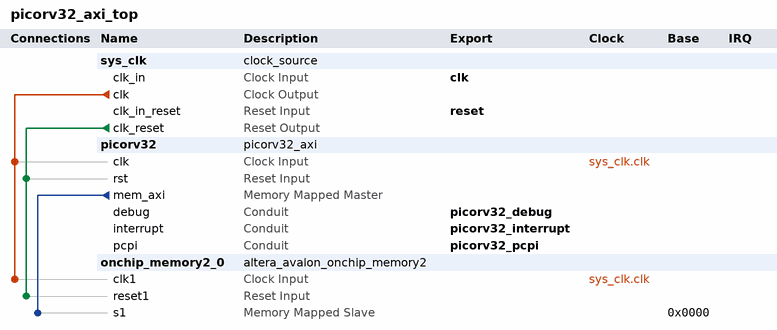
[diagram p0: system contents]
# Platform Designer (Qsys) system picorv32_axi_top, Cyclone V 5CEBA2F17A7
# Parameters at their usual value, and those the tool derives, are not listed.
package require -exact qsys 21.1
create_system picorv32_axi_top
set_project_property DEVICE_FAMILY {Cyclone V}
set_project_property DEVICE 5CEBA2F17A7

add_instance sys_clk clock_source 21.1
set_instance_parameter_value sys_clk clockFrequency 50000000

add_instance picorv32 picorv32_axi 1.0
set_instance_parameter_value picorv32 BARREL_SHIFTER 0
set_instance_parameter_value picorv32 CATCH_ILLINSN 1
set_instance_parameter_value picorv32 CATCH_MISALIGN 1
set_instance_parameter_value picorv32 COMPRESSED_ISA 0
set_instance_parameter_value picorv32 ENABLE_COUNTERS 1
set_instance_parameter_value picorv32 ENABLE_COUNTERS64 1
set_instance_parameter_value picorv32 ENABLE_DIV 0
set_instance_parameter_value picorv32 ENABLE_FAST_MUL 0
set_instance_parameter_value picorv32 ENABLE_IRQ 0
set_instance_parameter_value picorv32 ENABLE_IRQ_QREGS 1
set_instance_parameter_value picorv32 ENABLE_IRQ_TIMER 1
set_instance_parameter_value picorv32 ENABLE_MUL 0
set_instance_parameter_value picorv32 ENABLE_PCPI 0
set_instance_parameter_value picorv32 ENABLE_REGS_16_31 1
set_instance_parameter_value picorv32 ENABLE_REGS_DUALPORT 1
set_instance_parameter_value picorv32 ENABLE_TRACE 0
set_instance_parameter_value picorv32 LATCHED_IRQ 4294967295
set_instance_parameter_value picorv32 MASKED_IRQ 0
set_instance_parameter_value picorv32 PROGADDR_IRQ 16
set_instance_parameter_value picorv32 PROGADDR_RESET 0
set_instance_parameter_value picorv32 REGS_INIT_ZERO 0
set_instance_parameter_value picorv32 STACKADDR 4294967295
set_instance_parameter_value picorv32 TWO_CYCLE_ALU 0
set_instance_parameter_value picorv32 TWO_CYCLE_COMPARE 0
set_instance_parameter_value picorv32 TWO_STAGE_SHIFT 1

add_instance onchip_memory2_0 altera_avalon_onchip_memory2 21.1
set_instance_parameter_value onchip_memory2_0 dataWidth 32
set_instance_parameter_value onchip_memory2_0 dualPort false
set_instance_parameter_value onchip_memory2_0 initMemContent true
set_instance_parameter_value onchip_memory2_0 initializationFileName onchip_mem.hex
set_instance_parameter_value onchip_memory2_0 memorySize 4096

# connections
add_connection sys_clk.clk onchip_memory2_0.clk1 clock
add_connection sys_clk.clk picorv32.clk clock
add_connection sys_clk.clk_reset onchip_memory2_0.reset1 reset
add_connection sys_clk.clk_reset picorv32.rst reset
add_connection picorv32.mem_axi onchip_memory2_0.s1 avalon
set_connection_parameter_value picorv32.mem_axi/onchip_memory2_0.s1 baseAddress 0x0000

# exported interfaces
add_interface clk clock sink
set_interface_property clk EXPORT_OF sys_clk.clk_in
add_interface picorv32_debug conduit end
set_interface_property picorv32_debug EXPORT_OF picorv32.debug
add_interface picorv32_interrupt conduit end
set_interface_property picorv32_interrupt EXPORT_OF picorv32.interrupt
add_interface picorv32_pcpi conduit end
set_interface_property picorv32_pcpi EXPORT_OF picorv32.pcpi
add_interface reset reset sink
set_interface_property reset EXPORT_OF sys_clk.clk_in_reset

set_interconnect_requirement {$system} qsys_mm.clockCrossingAdapter HANDSHAKE
set_interconnect_requirement {$system} qsys_mm.enableEccProtection FALSE
set_interconnect_requirement {$system} qsys_mm.insertDefaultSlave FALSE
set_interconnect_requirement {$system} qsys_mm.maxAdditionalLatency 1

save_system picorv32_axi_top.qsys
